# EAGLE design keypad-encoder (EAGLE 7.7.0)
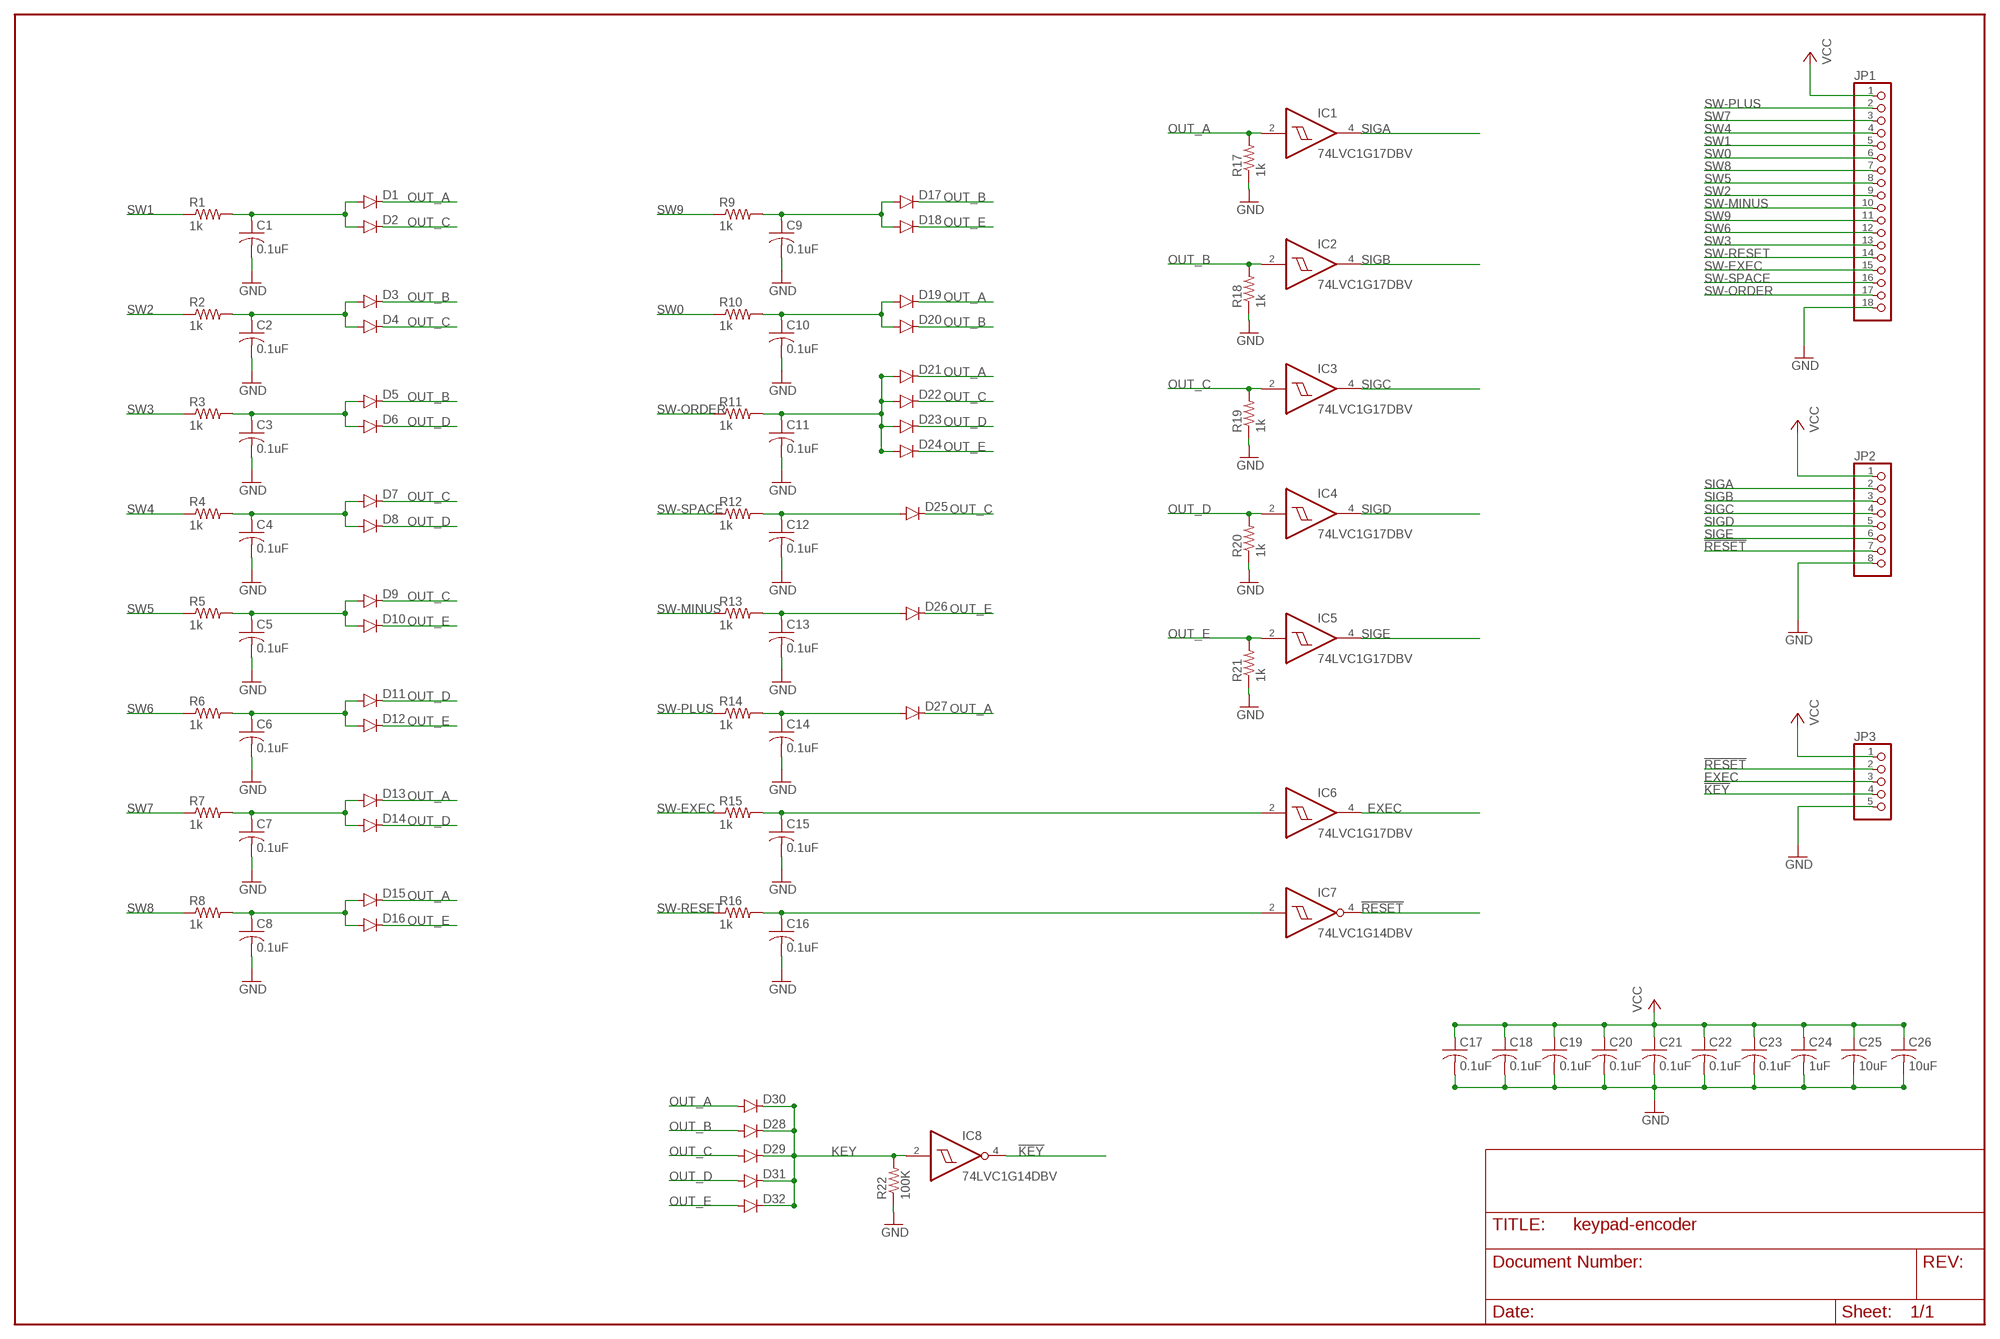
[diagram p0: schematic, sheet 1]

## Parts
C1  0.1uF  C-USC0805  [C0805]
C2  0.1uF  C-USC0805  [C0805]
C3  0.1uF  C-USC0805  [C0805]
C4  0.1uF  C-USC0805  [C0805]
C5  0.1uF  C-USC0805  [C0805]
C6  0.1uF  C-USC0805  [C0805]
C7  0.1uF  C-USC0805  [C0805]
C8  0.1uF  C-USC0805  [C0805]
C9  0.1uF  C-USC0805  [C0805]
C10  0.1uF  C-USC0805  [C0805]
C11  0.1uF  C-USC0805  [C0805]
C12  0.1uF  C-USC0805  [C0805]
C13  0.1uF  C-USC0805  [C0805]
C14  0.1uF  C-USC0805  [C0805]
C15  0.1uF  C-USC0805  [C0805]
C16  0.1uF  C-USC0805  [C0805]
C17  0.1uF  C-USC0805  [C0805]
C18  0.1uF  C-USC0805  [C0805]
C19  0.1uF  C-USC0805  [C0805]
C20  0.1uF  C-USC0805  [C0805]
C21  0.1uF  C-USC0805  [C0805]
C22  0.1uF  C-USC0805  [C0805]
C23  0.1uF  C-USC0805  [C0805]
C24  1uF  C-USC0805  [C0805]
C25  10uF  C-USC0805  [C0805]
C26  10uF  C-USC0805  [C0805]
D1  DIODEPTH  [DIODE-1N4001]
D2  DIODEPTH  [DIODE-1N4001]
D3  DIODEPTH  [DIODE-1N4001]
D4  DIODEPTH  [DIODE-1N4001]
D5  DIODEPTH  [DIODE-1N4001]
D6  DIODEPTH  [DIODE-1N4001]
D7  DIODEPTH  [DIODE-1N4001]
D8  DIODEPTH  [DIODE-1N4001]
D9  DIODEPTH  [DIODE-1N4001]
D10  DIODEPTH  [DIODE-1N4001]
D11  DIODEPTH  [DIODE-1N4001]
D12  DIODEPTH  [DIODE-1N4001]
D13  DIODEPTH  [DIODE-1N4001]
D14  DIODEPTH  [DIODE-1N4001]
D15  DIODEPTH  [DIODE-1N4001]
D16  DIODEPTH  [DIODE-1N4001]
D17  DIODEPTH  [DIODE-1N4001]
D18  DIODEPTH  [DIODE-1N4001]
D19  DIODEPTH  [DIODE-1N4001]
D20  DIODEPTH  [DIODE-1N4001]
D21  DIODEPTH  [DIODE-1N4001]
D22  DIODEPTH  [DIODE-1N4001]
D23  DIODEPTH  [DIODE-1N4001]
D24  DIODEPTH  [DIODE-1N4001]
D25  DIODEPTH  [DIODE-1N4001]
D26  DIODEPTH  [DIODE-1N4001]
D27  DIODEPTH  [DIODE-1N4001]
D28  DIODEPTH  [DIODE-1N4001]
D29  DIODEPTH  [DIODE-1N4001]
D30  DIODEPTH  [DIODE-1N4001]
D31  DIODEPTH  [DIODE-1N4001]
D32  DIODEPTH  [DIODE-1N4001]
IC1  74LVC1G17DBV  [SOT23-5]
IC2  74LVC1G17DBV  [SOT23-5]
IC3  74LVC1G17DBV  [SOT23-5]
IC4  74LVC1G17DBV  [SOT23-5]
IC5  74LVC1G17DBV  [SOT23-5]
IC6  74LVC1G17DBV  [SOT23-5]
IC7  74LVC1G14DBV  [SOT23-5]
IC8  74LVC1G14DBV  [SOT23-5]
JP1  PINHD-1X18  [1X18]
JP2  PINHD-1X8  [1X08]
JP3  PINHD-1X5  [1X05]
R1  1k  R-US_R0805  [R0805]
R2  1k  R-US_R0805  [R0805]
R3  1k  R-US_R0805  [R0805]
R4  1k  R-US_R0805  [R0805]
R5  1k  R-US_R0805  [R0805]
R6  1k  R-US_R0805  [R0805]
R7  1k  R-US_R0805  [R0805]
R8  1k  R-US_R0805  [R0805]
R9  1k  R-US_R0805  [R0805]
R10  1k  R-US_R0805  [R0805]
R11  1k  R-US_R0805  [R0805]
R12  1k  R-US_R0805  [R0805]
R13  1k  R-US_R0805  [R0805]
R14  1k  R-US_R0805  [R0805]
R15  1k  R-US_R0805  [R0805]
R16  1k  R-US_R0805  [R0805]
R17  1k  R-US_R0805  [R0805]
R18  1k  R-US_R0805  [R0805]
R19  1k  R-US_R0805  [R0805]
R20  1k  R-US_R0805  [R0805]
R21  1k  R-US_R0805  [R0805]
R22  100K  R-US_R0805  [R0805]

## Nets
!KEY: IC8.4(O) JP3.4
!RESET: IC7.4(O) JP2.7 JP3.2
EXEC: IC6.4(O) JP3.3
GND: C1.2 C2.2 C3.2 C4.2 C5.2 C6.2 C7.2 C8.2 C9.2 C10.2 C11.2 C12.2 C13.2 C14.2 C15.2 C16.2 C17.2 C18.2 C19.2 C20.2 C21.2 C22.2 C23.2 C24.2 C25.2 C26.2 JP1.18 JP2.8 JP3.5 R17.1 R18.1 R19.1 R20.1 R21.1 R22.1
KEY: D28.C D29.C D30.C D31.C D32.C IC8.2(I) R22.2
N$1: C11.1 D21.A D22.A D23.A D24.A R11.2
N$19: C1.1 D1.A D2.A R1.2
N$22: C2.1 D3.A D4.A R2.2
N$23: C3.1 D5.A D6.A R3.2
N$24: C4.1 D7.A D8.A R4.2
N$25: C5.1 D9.A D10.A R5.2
N$26: C6.1 D11.A D12.A R6.2
N$27: C7.1 D13.A D14.A R7.2
N$28: C8.1 D15.A D16.A R8.2
N$29: C9.1 D17.A D18.A R9.2
N$30: C10.1 D19.A D20.A R10.2
N$32: C12.1 D25.A R12.2
N$33: C13.1 D26.A R13.2
N$34: C14.1 D27.A R14.2
N$35: C15.1 IC6.2(I) R15.2
N$36: C16.1 IC7.2(I) R16.2
OUT_A: D1.C D13.C D15.C D19.C D21.C D27.C D30.A IC1.2(I) R17.2
OUT_B: D3.C D5.C D17.C D20.C D28.A IC2.2(I) R18.2
OUT_C: D2.C D4.C D7.C D9.C D22.C D25.C D29.A IC3.2(I) R19.2
OUT_D: D6.C D8.C D11.C D14.C D23.C D31.A IC4.2(I) R20.2
OUT_E: D10.C D12.C D16.C D18.C D24.C D26.C D32.A IC5.2(I) R21.2
SIGA: IC1.4(O) JP2.2
SIGB: IC2.4(O) JP2.3
SIGC: IC3.4(O) JP2.4
SIGD: IC4.4(O) JP2.5
SIGE: IC5.4(O) JP2.6
SW0: JP1.6 R10.1
SW1: JP1.5 R1.1
SW2: JP1.9 R2.1
SW3: JP1.13 R3.1
SW4: JP1.4 R4.1
SW5: JP1.8 R5.1
SW6: JP1.12 R6.1
SW7: JP1.3 R7.1
SW8: JP1.7 R8.1
SW9: JP1.11 R9.1
SW-EXEC: JP1.15 R15.1
SW-MINUS: JP1.10 R13.1
SW-ORDER: JP1.17 R11.1
SW-PLUS: JP1.2 R14.1
SW-RESET: JP1.14 R16.1
SW-SPACE: JP1.16 R12.1
VCC: C17.1 C18.1 C19.1 C20.1 C21.1 C22.1 C23.1 C24.1 C25.1 C26.1 JP1.1 JP2.1 JP3.1

## Power pins joined to a net without a drawn wire
GND: IC1.3(GND) IC2.3(GND) IC3.3(GND) IC4.3(GND) IC5.3(GND) IC6.3(GND) IC7.3(GND) IC8.3(GND)
VCC: IC1.5(VCC) IC2.5(VCC) IC3.5(VCC) IC4.5(VCC) IC5.5(VCC) IC6.5(VCC) IC7.5(VCC) IC8.5(VCC)

## Library data of the parts
C1-C26 = resistor:C-US: CAPACITOR, American symbol
D1-D32 = SparkFun-DiscreteSemi:DIODE: Diode These are standard reverse protection diodes and small signal diodes. SMA package can handle up to about 1A. SOD-323 can handle about 200mA. What the SOD-323 package when ordering, there are some mfgs out there that are 5-pin packages.
IC1-IC6 = 74xx-little-us:74*1G17: Single Schmitt-Trigger Buffer
IC7 IC8 = 74xx-little-us:74*1G14: Single Schmitt-Trigger Inverter Gate
JP1 = pinhead:PINHD-1X18: PIN HEADER
JP2 = custom-pinhead:PINHD-1X8: PIN HEADER
JP3 = custom-pinhead:PINHD-1X5: PIN HEADER
R1-R22 = resistor:R-US_: RESISTOR, American symbol

## Board
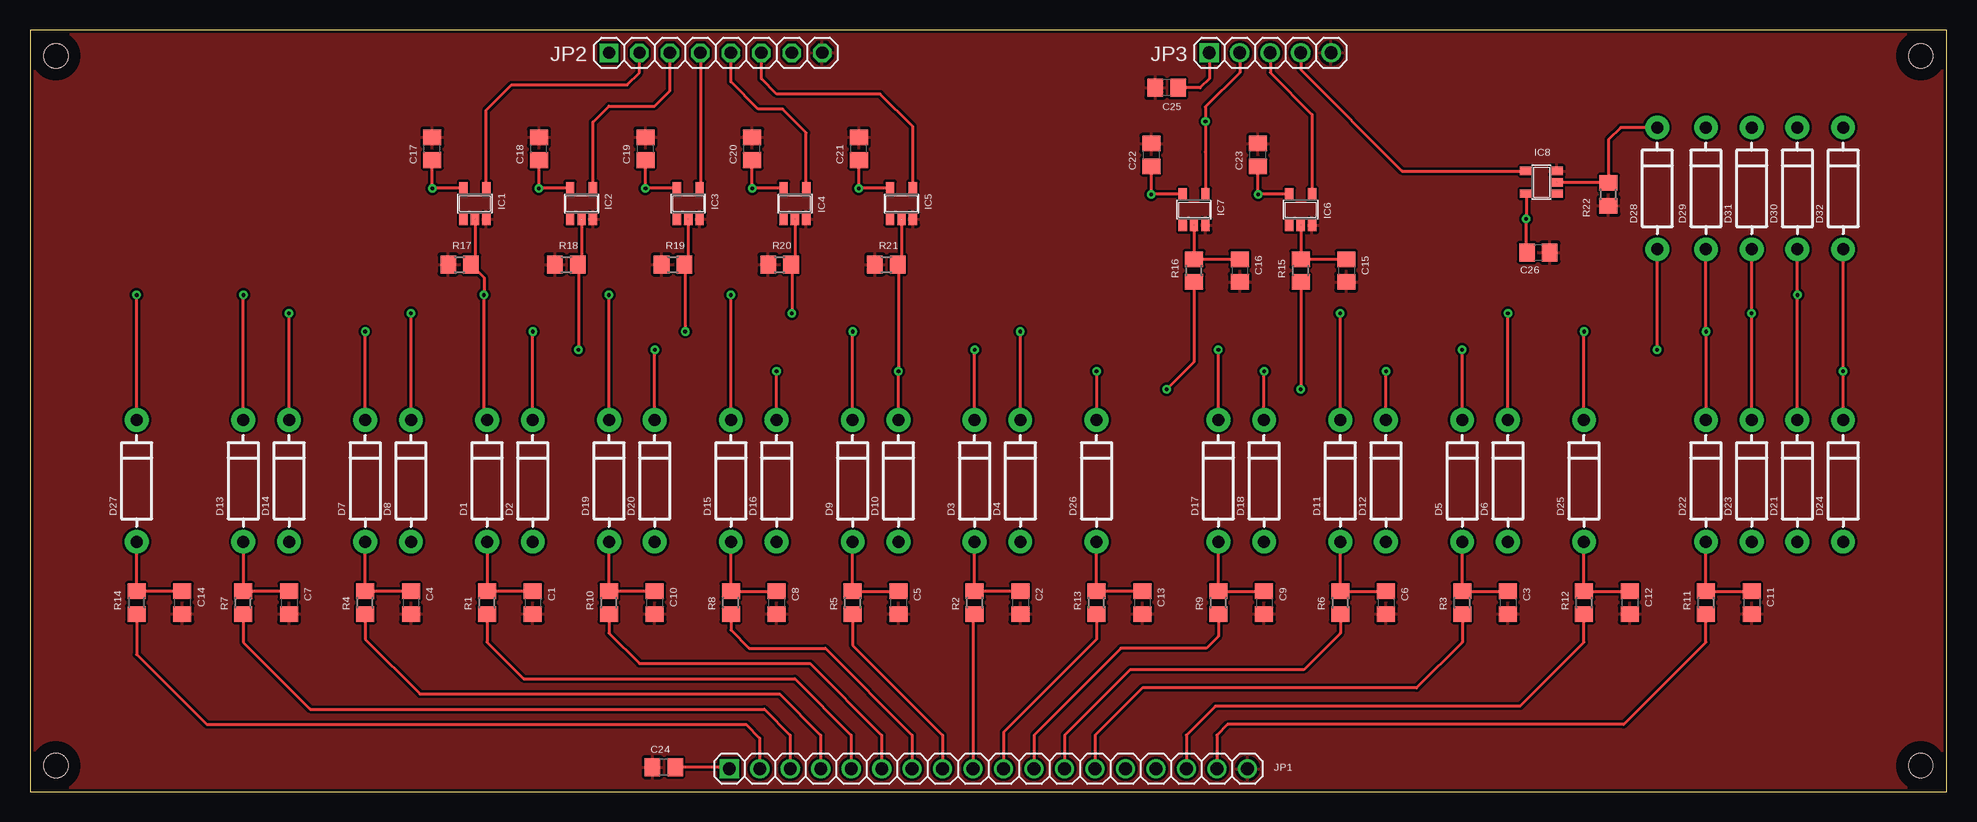
[diagram p1: board, top side]
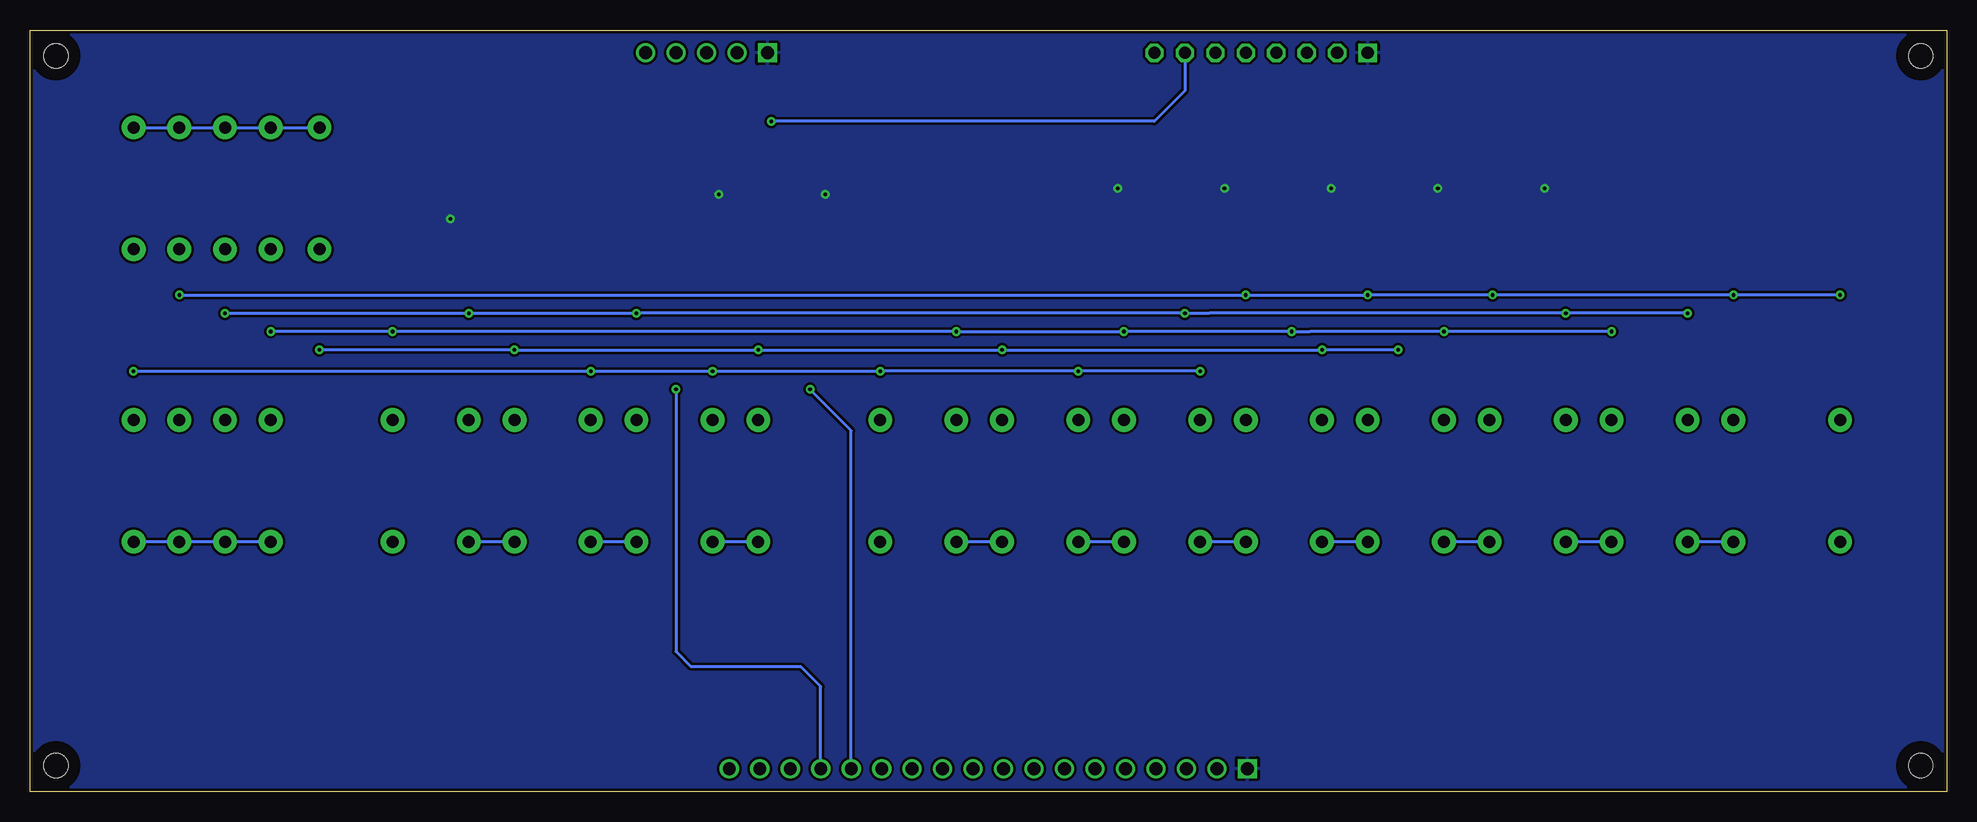
[diagram p2: board, bottom side, seen from below]

Size 159.77 x 63.5 mm. Coordinates in mm from the lower left corner, seen from the top.
Outline: 0,0 159.77,0 159.77,63.5 0,63.5 0,0
Copper layers (1*16): Top 0.035mm / dielectric 1.5mm / Bottom 0.035mm
Design rules "default *": minimum track width 10mil, minimum drill 12mil, track to track 8mil, track to pad 8mil, pad to pad 8mil, via to via 8mil, smd to smd 8mil, copper to edge 10mil, drill to drill 8mil, minimum pad ring 10mil, minimum via ring 8mil, stop-mask expansion 4mil, vias tented up to drill 0mil, thermal gap 10mil
Holes 2.01 mm at 2.16,2.16 2.16,61.34 157.61,61.34 157.61,2.16
tRestrict: area 0.2,0.2 to 4.2,4.2; area 0.2,59.3 to 4.2,63.3; area 155.6,59.3 to 159.6,63.3; area 155.6,0.2 to 159.6,4.2
bRestrict: area 0.2,0.2 to 4.2,4.2; area 0.2,59.3 to 4.2,63.3; area 155.6,59.3 to 159.6,63.3; area 155.6,0.2 to 159.6,4.2

### Footprints (pad centres in the part's own frame; a part is rotated, then mirrored left to right if it is on the bottom)
C0805 = smd 1.3 x 1.5: 1 -0.95,0; 2 0.95,0
DIODE-1N4001 = drill 1 pad 1.981: A -5.08,0; C 5.08,0
SOT23-5 = smd 0.69 x 0.99: 1 -0.95,-1.29; 2 0,-1.29; 3 0.95,-1.29; 4 0.95,1.3; 5 -0.95,1.3
1X18 = drill 1.067 square: 1 -21.59,0 | drill 1.067: 2 -19.05,0; 3 -16.51,0; 4 -13.97,0; 5 -11.43,0; 6 -8.89,0; 7 -6.35,0; 8 -3.81,0; 9 -1.27,0; 10 1.27,0; 11 3.81,0; 12 6.35,0; 13 8.89,0; 14 11.43,0; 15 13.97,0; 16 16.51,0; 17 19.05,0; 18 21.59,0
1X08 = drill 1.016 square: 1 -8.89,0 | drill 1.016 octagon: 2 -6.35,0; 3 -3.81,0; 4 -1.27,0; 5 1.27,0; 6 3.81,0; 7 6.35,0; 8 8.89,0
1X05 = drill 1.067 square: 1 -5.08,0 | drill 1.067: 2 -2.54,0; 3 0,0; 4 2.54,0; 5 5.08,0
R0805 = smd 1.3 x 1.5: 1 -0.95,0; 2 0.95,0

### Placement (x,y rotation side)
C1  41.91,15.75 270 top
C2  82.55,15.75 270 top
C3  123.19,15.75 270 top
C4  31.75,15.75 270 top
C5  72.39,15.75 270 top
C6  113.03,15.75 270 top
C7  21.59,15.75 270 top
C8  62.23,15.75 270 top
C9  102.87,15.75 270 top
C10  52.07,15.75 270 top
C11  143.51,15.75 270 top
C12  133.35,15.75 270 top
C13  92.71,15.75 270 top
C14  12.7,15.75 270 top
C15  109.73,43.43 270 top
C16  100.84,43.43 270 top
C17  33.53,53.59 90 top
C18  42.42,53.59 90 top
C19  51.31,53.59 90 top
C20  60.2,53.59 90 top
C21  69.09,53.59 90 top
C22  93.47,53.09 90 top
C23  102.36,53.09 90 top
C24  52.83,2.03 180 top
C25  94.74,58.67 180 top
C26  125.73,44.96 0 top
D1  38.1,25.91 90 top
D2  41.91,25.91 90 top
D3  78.74,25.91 90 top
D4  82.55,25.91 90 top
D5  119.38,25.91 90 top
D6  123.19,25.91 90 top
D7  27.94,25.91 90 top
D8  31.75,25.91 90 top
D9  68.58,25.91 90 top
D10  72.39,25.91 90 top
D11  109.22,25.91 90 top
D12  113.03,25.91 90 top
D13  17.78,25.91 90 top
D14  21.59,25.91 90 top
D15  58.42,25.91 90 top
D16  62.23,25.91 90 top
D17  99.06,25.91 90 top
D18  102.87,25.91 90 top
D19  48.26,25.91 90 top
D20  52.07,25.91 90 top
D21  147.32,25.91 90 top
D22  139.7,25.91 90 top
D23  143.51,25.91 90 top
D24  151.13,25.91 90 top
D25  129.54,25.91 90 top
D26  88.9,25.91 90 top
D27  8.89,25.91 90 top
D28  135.64,50.29 90 top
D29  139.7,50.29 90 top
D30  147.32,50.29 90 top
D31  143.51,50.29 90 top
D32  151.13,50.29 90 top
IC1  37.08,49.02 0 top
IC2  45.97,49.02 0 top
IC3  54.86,49.02 0 top
IC4  63.75,49.02 0 top
IC5  72.64,49.02 0 top
IC6  105.92,48.51 0 top
IC7  97.03,48.51 0 top
IC8  125.98,50.8 90 top
JP1  79.88,1.91 0 top
JP2  57.15,61.59 0 top
JP3  103.38,61.59 0 top
R1  38.1,15.75 90 top
R2  78.74,15.75 90 top
R3  119.38,15.75 90 top
R4  27.94,15.75 90 top
R5  68.58,15.75 90 top
R6  109.22,15.75 90 top
R7  17.78,15.75 90 top
R8  58.42,15.75 90 top
R9  99.06,15.75 90 top
R10  48.26,15.75 90 top
R11  139.7,15.75 90 top
R12  129.54,15.75 90 top
R13  88.9,15.75 90 top
R14  8.89,15.75 90 top
R15  105.92,43.43 90 top
R16  97.03,43.43 90 top
R17  35.81,43.94 0 top
R18  44.7,43.94 0 top
R19  53.59,43.94 0 top
R20  62.48,43.94 0 top
R21  71.37,43.94 0 top
R22  131.57,49.78 90 top

### Tracks (layer width: path | path; a pad name or v marks a point on that pad's centre or on a via)
!KEY
  Top 0.254: JP3.4 105.92,60.2 114.37,51.75 IC8.4
!RESET  (via drill 0.3)
  Top 0.254: JP3.2 100.84,59.94 97.98,57.08 v97.98,55.88 97.98,53.34 IC7.4
  Bottom 0.254: JP2.7 63.5,58.42 66.04,55.88 v97.98,55.88
EXEC
  Top 0.254: JP3.3 103.38,59.94 106.87,56.45 IC6.4
GND
  pour Top: 0,0 159.77,0 159.77,63.5 0,63.5
KEY
  Top 0.254: D28.C 132.59,55.37 131.57,54.36 R22.2 131.51,50.8 IC8.2
  Bottom 0.254: D32.C D30.C D31.C D29.C D28.C
N$1
  Top 0.254: D22.A R11.2 C11.1
  Bottom 0.254: D22.A D23.A D21.A D24.A
N$19
  Top 0.254: C1.1 R1.2 D1.A
  Bottom 0.254: D1.A D2.A
N$22
  Top 0.254: D3.A R2.2 C2.1
  Bottom 0.254: D3.A D4.A
N$23
  Top 0.254: D5.A R3.2 C3.1
  Bottom 0.254: D5.A D6.A
N$24
  Top 0.254: D7.A R4.2 C4.1
  Bottom 0.254: D7.A D8.A
N$25
  Top 0.254: D9.A R5.2 C5.1
  Bottom 0.254: D9.A D10.A
N$26
  Top 0.254: D11.A R6.2 C6.1
  Bottom 0.254: D11.A D12.A
N$27
  Top 0.254: C7.1 R7.2 D13.A
  Bottom 0.254: D13.A D14.A
N$28
  Top 0.254: D15.A R8.2 C8.1
  Bottom 0.254: D15.A D16.A
N$29
  Top 0.254: D17.A R9.2 C9.1
  Bottom 0.254: D17.A D18.A
N$30
  Top 0.254: D19.A R10.2 C10.1
  Bottom 0.254: D19.A D20.A
N$32
  Top 0.254: D25.A R12.2 C12.1
N$33
  Top 0.254: C13.1 R13.2 D26.A
N$34
  Top 0.254: D27.A R14.2 C14.1
N$35
  Top 0.254: IC6.2 R15.2 C15.1
N$36
  Top 0.254: IC7.2 R16.2 C16.1
OUT_A  (via drill 0.3)
  Top 0.254: IC1.2 37.08,44.26 R17.2 37.85,42.86 v37.85,41.4 37.85,31.24 D1.C | D27.C v8.89,41.4 | D19.C v48.26,41.4 | D15.C v58.42,41.4 | D13.C v17.78,41.4 | D21.C v147.32,41.4 D30.A
  Bottom 0.254: v8.89,41.4 v17.78,41.4 v37.85,41.4 v48.26,41.4 v58.42,41.4 v147.32,41.4
OUT_B  (via drill 0.3)
  Top 0.254: IC2.2 45.97,44.26 R18.2 45.72,43.88 v45.72,36.83 | D20.C v52.07,36.83 | D3.C v78.74,36.83 | D17.C v99.06,36.83 | D5.C v119.38,36.83 | v135.64,36.83 D28.A
  Bottom 0.254: v135.64,36.83 v119.38,36.83 v99.06,36.83 v78.74,36.83 v52.07,36.83 v45.72,36.83
OUT_C  (via drill 0.3)
  Top 0.254: IC3.2 54.86,44.26 R19.2 54.61,43.88 v54.61,38.35 | D7.C v27.94,38.35 | D2.C v41.91,38.35 | D9.C v68.58,38.35 | D4.C v82.55,38.35 | D22.C v139.7,38.35 D29.A | D25.C v129.54,38.35
  Bottom 0.254: v27.94,38.35 v41.91,38.35 53.09,38.35 v54.61,38.35 v68.58,38.35 v82.55,38.35 v129.54,38.35 v139.7,38.35
OUT_D  (via drill 0.3)
  Top 0.254: IC4.2 63.75,44.26 R20.2 63.5,43.88 v63.5,39.88 | D14.C v21.59,39.88 | D8.C v31.75,39.88 | D11.C v109.22,39.88 | D6.C v123.19,39.88 | D23.C v143.51,39.88 D31.A
  Bottom 0.254: v21.59,39.88 v31.75,39.88 61.47,39.88 v63.5,39.88 v109.22,39.88 v123.19,39.88 v143.51,39.88
OUT_E  (via drill 0.3)
  Top 0.254: IC5.2 72.64,44.26 R21.2 72.39,43.88 v72.39,35.05 D10.C | D24.C v151.13,35.05 D32.A | D12.C v113.03,35.05 | D16.C v62.23,35.05 | D18.C v102.87,35.05 | v88.9,35.05 D26.C
  Bottom 0.254: v151.13,35.05 v113.03,35.05 v102.87,35.05 v88.9,35.05 v72.39,35.05 v62.23,35.05
SIGA
  Top 0.254: IC1.4 38.03,56.83 40.13,58.93 49.78,58.93 50.8,59.94 JP2.2
SIGB
  Top 0.254: IC2.4 46.92,55.81 48.26,57.15 52.07,57.15 53.34,58.42 JP2.3
SIGC
  Top 0.254: JP2.4 55.88,50.39 IC3.4
SIGD
  Top 0.254: IC4.4 64.7,54.93 62.74,56.9 60.71,56.9 58.42,59.18 JP2.5
SIGE
  Top 0.254: IC5.4 73.59,55.44 70.87,58.17 62.23,58.17 60.96,59.44 JP2.6
SW0
  Top 0.254: R10.1 48.26,13.21 50.8,10.67 65.02,10.67 70.99,4.7 JP1.6
SW1
  Top 0.254: R1.1 38.1,12.45 41.15,9.4 63.75,9.4 68.45,4.7 JP1.5
SW2
  Top 0.254: R2.1 78.61,14.67 JP1.9
SW3
  Top 0.254: R3.1 119.38,12.45 115.57,8.64 92.71,8.64 88.77,4.7 JP1.13
SW4
  Top 0.254: R4.1 27.94,12.7 32.51,8.13 62.48,8.13 65.91,4.7 JP1.4
SW5
  Top 0.254: R5.1 68.58,12.19 76.07,4.7 JP1.8
SW6
  Top 0.254: R6.1 109.22,13.21 106.17,10.16 91.69,10.16 86.23,4.7 JP1.12
SW7
  Top 0.254: R7.1 17.78,12.45 23.37,6.86 61.21,6.86 63.37,4.7 JP1.3
SW8
  Top 0.254: R8.1 58.42,13.46 59.94,11.94 66.29,11.94 73.53,4.7 JP1.7
SW9
  Top 0.254: R9.1 99.06,12.95 98.04,11.94 90.93,11.94 83.69,4.7 JP1.11
SW-EXEC  (via drill 0.3)
  Top 0.254: R15.1 v105.92,33.53
  Bottom 0.254: JP1.15 93.85,8.76 95.5,10.41 104.65,10.41 105.92,11.68 v105.92,33.53
SW-MINUS
  Top 0.254: R13.1 88.9,12.7 81.15,4.95 JP1.10
SW-ORDER
  Top 0.254: R11.1 139.7,12.45 132.84,5.59 99.82,5.59 98.93,4.7 JP1.17
SW-PLUS
  Top 0.254: R14.1 8.89,11.43 14.73,5.59 59.69,5.59 60.83,4.45 JP1.2
SW-RESET  (via drill 0.3)
  Top 0.254: R16.1 97.03,35.81 v94.74,33.53
  Bottom 0.254: JP1.14 91.31,30.1 v94.74,33.53
SW-SPACE
  Top 0.254: R12.1 129.54,12.45 124.21,7.11 98.81,7.11 96.39,4.7 JP1.16
VCC  (via drill 0.3)
  Top 0.254: IC1.5 33.53,50.32 | 33.53,50.32 v33.53,50.29 | IC2.5 42.42,50.32 | 42.42,50.32 v42.42,50.29 | IC3.5 51.31,50.32 | 51.31,50.32 v51.31,50.29 | IC4.5 60.2,50.32 | 60.2,50.32 v60.2,50.29 | IC5.5 69.09,50.32 | 69.09,50.32 v69.09,50.29 | IC7.5 93.47,49.81 | 93.47,49.81 v93.47,49.78 | IC6.5 102.36,49.81 | 102.36,49.81 v102.36,49.78 | 33.53,50.32 C17.1 | 42.42,50.32 C18.1 | 51.31,50.32 C19.1 | 60.2,50.32 C20.1 | 69.09,50.32 C21.1 | 93.47,49.81 C22.1 | 102.36,49.81 C23.1 | JP1.1 58.17,2.03 C24.1 | IC8.5 124.71,49.82 v124.71,47.75 124.71,45.02 arc90 C26.1 | JP3.1 98.3,59.44 97.54,58.67 C25.1
  pour Bottom: 0,0 159.77,0 159.77,63.5 0,63.5

### Text on the board
Document: Keypad Encoder